# EAGLE design helios_monitor (EAGLE 9.2.2)
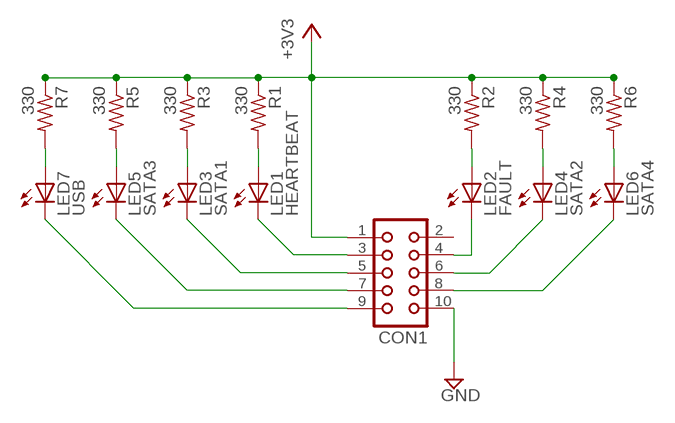
[diagram p0: schematic, sheet 1]

## Parts
CON1  CON10  [CON10]
LED1  HEARTBEAT  LED5MM  [LED5MM]
LED2  FAULT  LED5MM  [LED5MM]
LED3  SATA1  LED5MM  [LED5MM]
LED4  SATA2  LED5MM  [LED5MM]
LED5  SATA3  LED5MM  [LED5MM]
LED6  SATA4  LED5MM  [LED5MM]
LED7  USB  LED5MM  [LED5MM]
R1  330  R-US_0207/10  [0207/10]
R2  330  R-US_0207/10  [0207/10]
R3  330  R-US_0207/10  [0207/10]
R4  330  R-US_0207/10  [0207/10]
R5  330  R-US_0207/10  [0207/10]
R6  330  R-US_0207/10  [0207/10]
R7  330  R-US_0207/10  [0207/10]

## Nets
+3V3: CON1.1 R1.1 R2.1 R3.1 R4.1 R5.1 R6.1 R7.1
GND: CON1.10
N$1: LED1.A R1.2
N$2: LED3.A R3.2
N$3: LED5.A R5.2
N$4: LED7.A R7.2
N$5: LED2.A R2.2
N$6: LED4.A R4.2
N$7: LED6.A R6.2
N$9: CON1.3 LED1.K(C)
N$10: CON1.5 LED3.K(C)
N$11: CON1.7 LED5.K(C)
N$12: CON1.9 LED7.K(C)
N$13: CON1.4 LED2.K(C)
N$14: CON1.6 LED4.K(C)
N$15: CON1.8 LED6.K(C)
Unconnected: CON1.2

## Library data of the parts
CON1 = con-harting:CON10: CONNECTOR; OC_FARNELL: unknown; OC_NEWARK: unknown
LED1-LED7 = led:LED: LED OSRAM: - CHIPLED LG R971, LG N971, LY N971, LG Q971, LY Q971, LO R971, LY R971 LH N974, LH R974 LS Q976, LO Q976, LY Q976 LO Q996 - Hyper CHIPLED LW Q18S LB Q993, LB Q99A, LB R99A - SideLED LS A670, LO A670, LY A670, LG A670, LP A670 LB A673, LV A673, LT A673, LW A673 LH A674 LY A675 LS A676, LA A676, LO A676, LY A676, LW A676 LS A679, LY A679, LG A679 - Hyper Micro SIDELED® LS Y876, LA Y876, LO Y876, LY Y876 LT Y87S - SmartLED LW L88C, LW L88S LB L89C, LB L89S, LG L890 LS L89K, LO L89K, LY L89K LS L896, LA L896, LO L896, LY L896 - TOPLED LS T670, LO T670, LY T670, LG T670, LP T670 LSG T670, LSP T670, LSY T670, LOP T670, LYG T670 LG T671, LOG T671, LSG T671 LB T673, LV T673, LT T673, LW T673 LH T674 LS T676, LA T676, LO T676, LY T676, LB T676, LH T676, LSB T676, LW T676 LB T67C, LV T67C, LT T67C, LS T67K, LO T67K, LY T67K, LW E67C LS E67B, LA E67B, LO E67B, LY E67B, LB E67C, LV E67C, LT E67C LW T67C LS T679, LY T679, LG T679 LS T770, LO T770, LY T770, LG T770, LP T770 LB T773, LV T773, LT T773, LW T773 LH T774 LS E675, LA E675, LY E675, LS T675 LS T776, LA T776, LO T776, LY T776, LB T776 LHGB T686 LT T68C, LB T68C - Hyper Mini TOPLED® LB M676 - Mini TOPLED Santana® LG M470 LS M47K, LO M47K, LY M47K Source: http://www.osram.convergy.de LUXEON: - LUMILED® LXK2-PW12-R00, LXK2-PW12-S00, LXK2-PW14-U00, LXK2-PW14-V00 LXK2-PM12-R00, LXK2-PM12-S00, LXK2-PM14-U00 LXK2-PE12-Q00, LXK2-PE12-R00, LXK2-PE12-S00, LXK2-PE14-T00, LXK2-PE14-U00 LXK2-PB12-K00, LXK2-PB12-L00, LXK2-PB12-M00, LXK2-PB14-N00, LXK2-PB14-P00, LXK2-PB14-Q00 LXK2-PR12-L00, LXK2-PR12-M00, LXK2-PR14-Q00, LXK2-PR14-R00 LXK2-PD12-Q00, LXK2-PD12-R00, LXK2-PD12-S00 LXK2-PH12-R00, LXK2-PH12-S00 LXK2-PL12-P00, LXK2-PL12-Q00, LXK2-PL12-R00 Source: www.luxeon.com KINGBRIGHT: KA-3528ASYC Source: www.kingbright.com
R1-R7 = rcl:R-US_: RESISTOR, American symbol; SPICEPREFIX: R

## Board
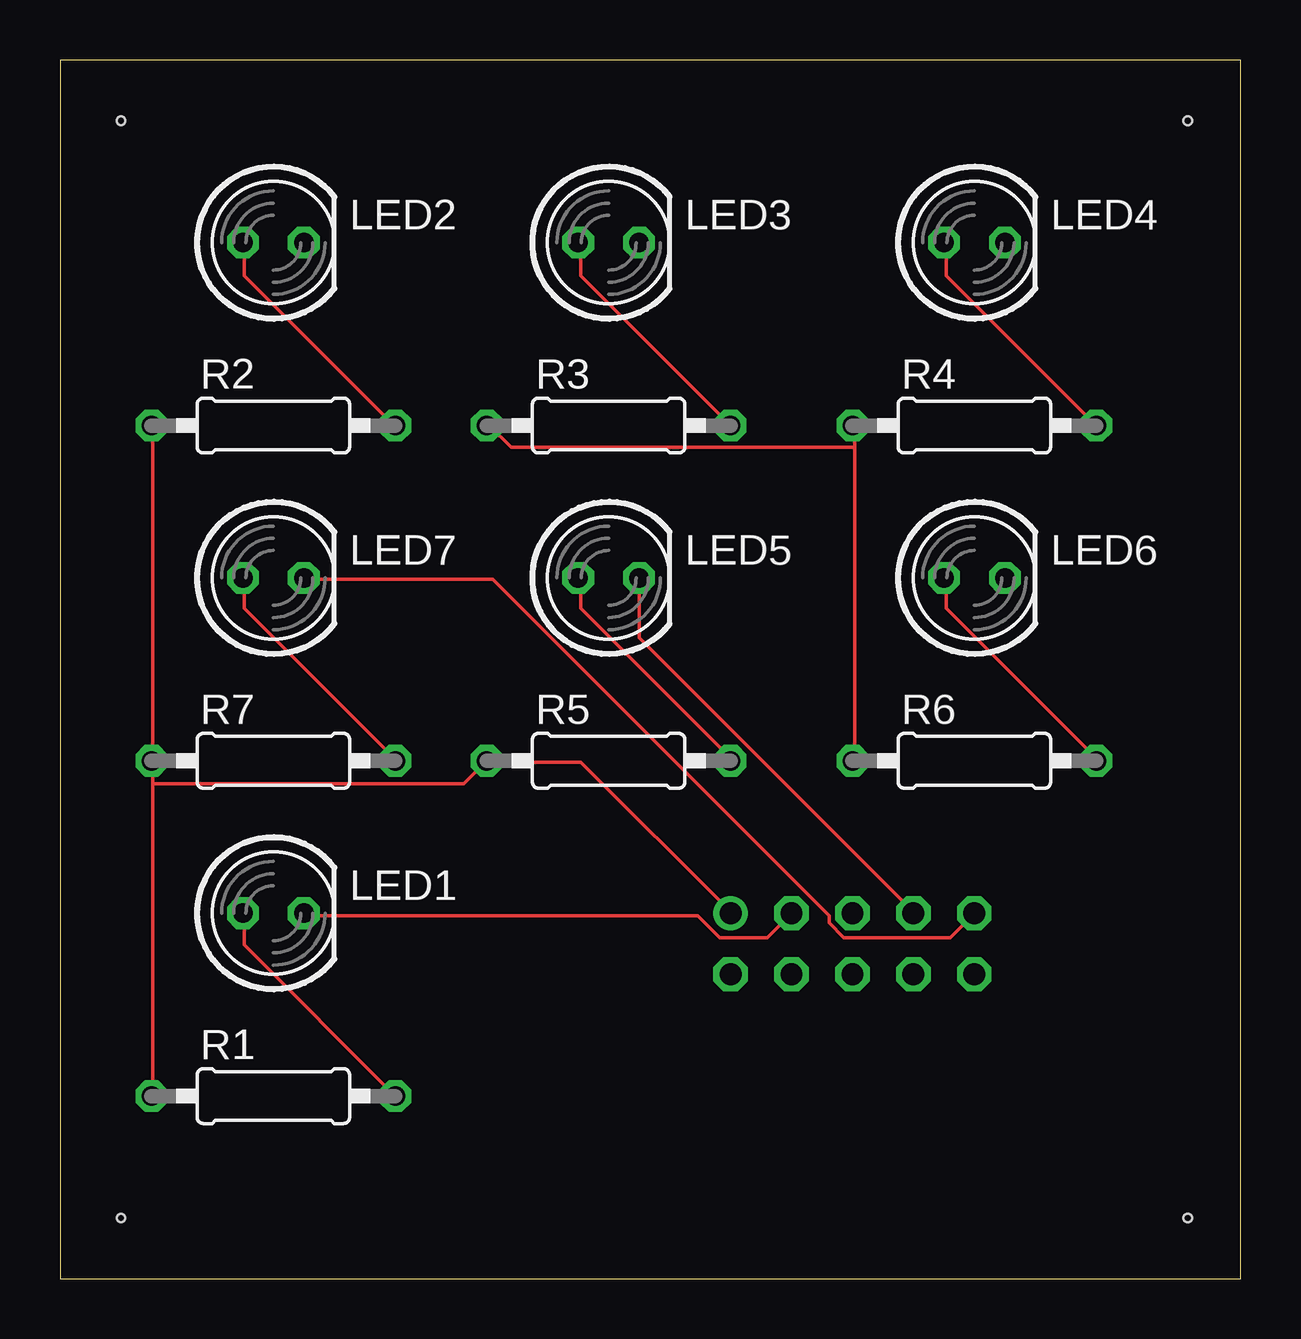
[diagram p1: board, top side]
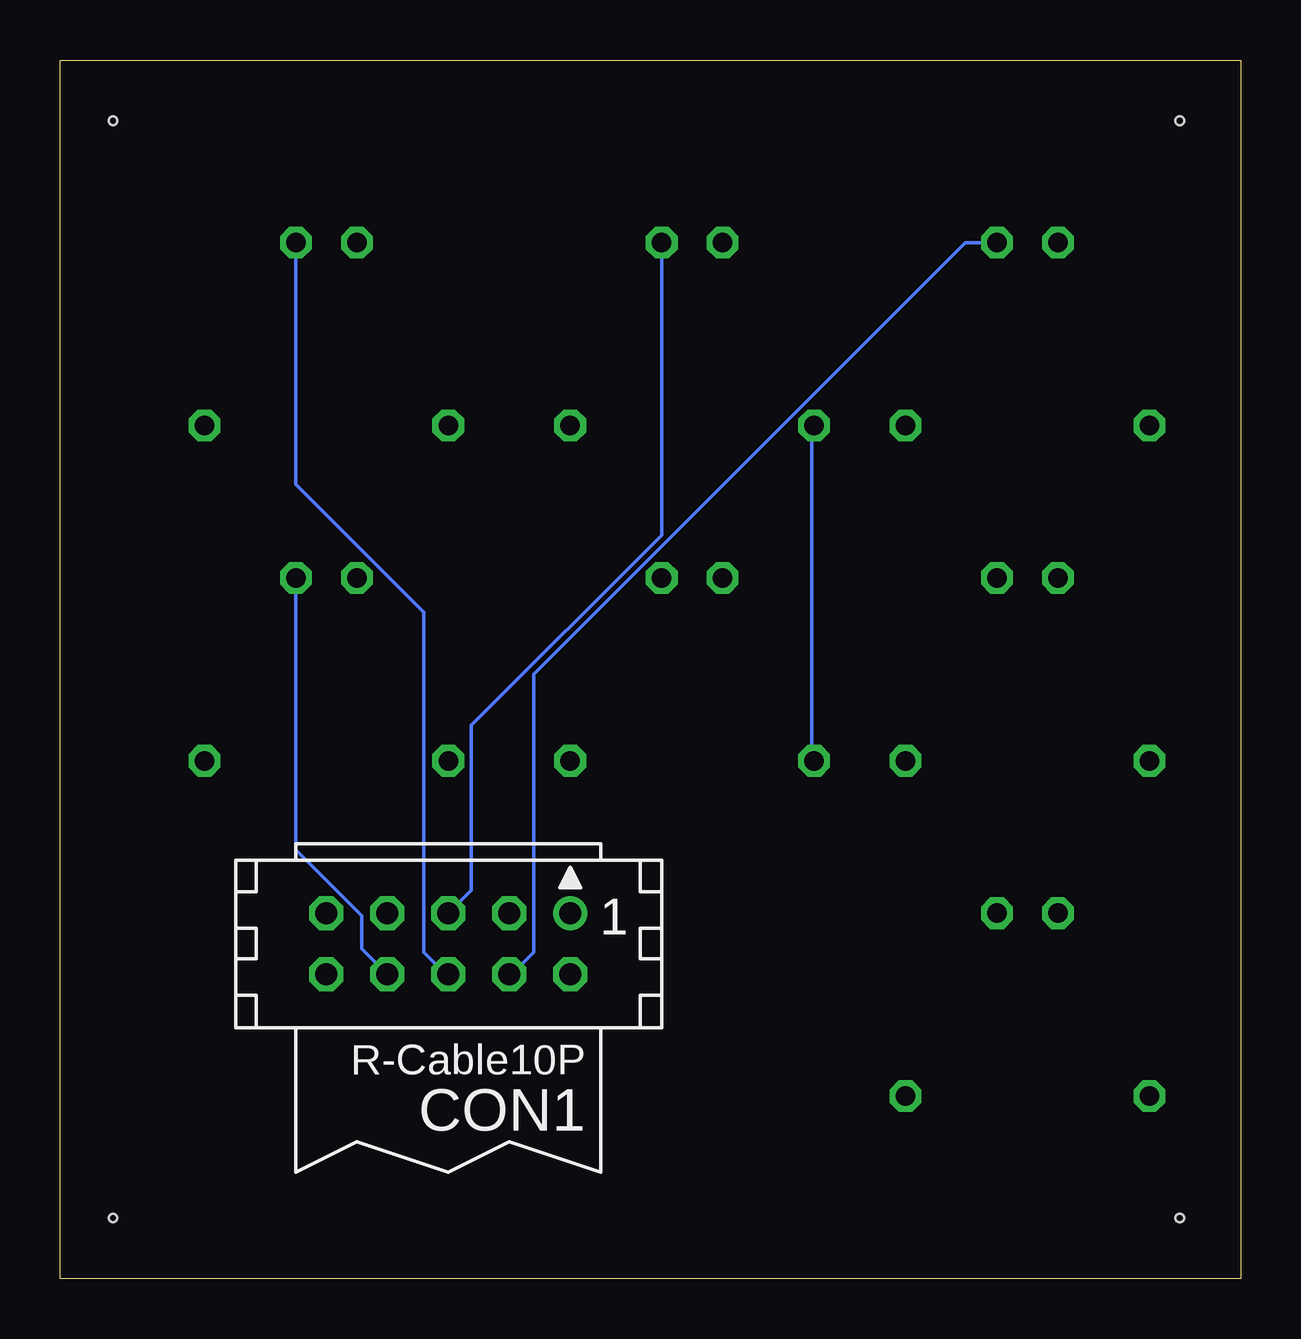
[diagram p2: board, bottom side, seen from below]

Size 49.2 x 50.79 mm. Coordinates in mm from the lower left corner, seen from the top.
Outline: 0,0 49.2,0 49.2,50.79 0,50.79 0,0
Copper layers (1*16): Top 0.035mm / dielectric 1.5mm / Bottom 0.035mm
Design rules "default": minimum track width 6mil, minimum drill 0.35mm, track to track 6mil, track to pad 6mil, pad to pad 6mil, via to via 6mil, smd to smd 6mil, copper to edge 40mil, drill to drill 6mil, minimum pad ring 10mil, minimum via ring 8mil, stop-mask expansion 4mil, vias tented up to drill 0mil, thermal gap 10mil
Holes 0.35 mm at 2.54,48.26 46.99,48.26 46.99,2.54 2.54,2.54

### Footprints (pad centres in the part's own frame; a part is rotated, then mirrored left to right if it is on the bottom)
CON10 = drill 0.914: 1 -5.08,-1.27 | drill 0.914 octagon: 2 -5.08,1.27; 3 -2.54,-1.27; 4 -2.54,1.27; 5 0,-1.27; 6 0,1.27; 7 2.54,-1.27; 8 2.54,1.27; 9 5.08,-1.27; 10 5.08,1.27
LED5MM = drill 0.813 octagon: A -1.27,0; K 1.27,0
0207/10 = drill 0.813 octagon: 1 -5.08,0; 2 5.08,0

### Placement (x,y rotation side)
CON1  33.02,13.97 180 bottom
LED1  8.89,15.24 0 top
LED2  8.89,43.18 0 top
LED3  22.86,43.18 0 top
LED4  38.1,43.18 0 top
LED5  22.86,29.21 0 top
LED6  38.1,29.21 0 top
LED7  8.89,29.21 0 top
R1  8.89,7.62 0 top
R2  8.89,35.56 0 top
R3  22.86,35.56 0 top
R4  38.1,35.56 0 top
R5  22.86,21.59 0 top
R6  38.1,21.59 0 top
R7  8.89,21.59 0 top

### Tracks (layer width: path | path; a pad name or v marks a point on that pad's centre or on a via)
+3V3
  Top 0.152: 3.86,20.62 3.86,21.54 R7.1 3.86,21.69 3.86,35.56 R2.1 | 3.86,20.62 3.86,7.67 R1.1 | 33.12,34.65 33.12,35.56 R4.1 | 33.12,34.65 33.12,21.69 R6.1 | CON1.1 27.94,15.29 21.69,21.54 17.88,21.54 R5.1 16.82,20.62 3.86,20.62 | 33.12,34.65 18.8,34.65 17.88,35.56 R3.1
  Bottom 0.152: R3.1 17.88,35.56 17.88,21.69 R5.1
N$1
  Top 0.152: R1.2 7.67,13.92 7.67,15.14 LED1.A
N$2
  Top 0.152: R3.2 21.69,41.81 21.69,43.18 LED3.A
N$3
  Top 0.152: LED5.A 21.69,29.16 21.69,27.94 27.94,21.69 R5.2
N$4
  Top 0.152: LED7.A 7.67,29.16 7.67,27.94 13.92,21.69 R7.2
N$5
  Top 0.152: LED2.A 7.67,43.18 7.67,41.81 13.92,35.56 R2.2
N$6
  Top 0.152: R4.2 36.93,41.81 36.93,43.18 LED4.A
N$7
  Top 0.152: LED6.A 36.93,29.16 36.93,27.94 43.18,21.69 R6.2
N$9
  Top 0.152: CON1.3 29.46,14.22 27.48,14.22 26.57,15.14 10.26,15.14 LED1.K
N$10
  Bottom 0.152: LED3.K 24.13,30.99 32.05,23.06 32.05,16.2 CON1.5
N$11
  Top 0.152: LED5.K 24.13,26.72 35.56,15.29 CON1.7
N$12
  Top 0.152: CON1.9 37.08,14.22 32.66,14.22 32.05,14.83 32.05,15.14 18.03,29.16 10.26,29.16 LED7.K
N$13
  Bottom 0.152: LED2.K 11.48,43.18 29.46,25.2 29.46,13.61 30.38,12.7 CON1.4
N$14
  Bottom 0.152: LED4.K 39.37,33.12 34.04,27.79 34.04,13.61 33.12,12.7 CON1.6
N$15
  Bottom 0.152: LED6.K 39.37,17.88 36.63,15.14 36.63,13.77 CON1.8